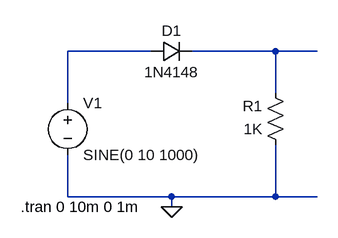
[diagram p0: schematic Positive and Negative Clipper.asc]
Positive and Negative Clipper.asc, the LTspice schematic file:
Version 4
SHEET 1 880 680
WIRE 368 144 240 144
WIRE 560 144 432 144
WIRE 624 144 560 144
WIRE 560 208 560 144
WIRE 240 224 240 144
WIRE 240 368 240 304
WIRE 400 368 240 368
WIRE 560 368 560 288
WIRE 560 368 400 368
WIRE 624 368 560 368
WIRE 400 384 400 368
FLAG 400 384 0
SYMBOL res 576 304 R180
WINDOW 0 36 76 Left 2
WINDOW 3 36 40 Left 2
SYMATTR InstName R1
SYMATTR Value 1K
SYMBOL diode 368 160 R270
WINDOW 0 32 32 VTop 2
WINDOW 3 0 32 VBottom 2
SYMATTR InstName D1
SYMATTR Value 1N4148
SYMBOL voltage 240 208 R0
SYMATTR InstName V1
SYMATTR Value SINE(0 10 1000)
TEXT 168 384 Left 2 !.tran 0 10m 0 1m

The netlist it stands for:
* Positive and Negative Clipper.asc
R1 0 N002 1K
D1 N001 N002 1N4148
V1 N001 0 SINE(0 10 1000)
.model D D
.lib standard.dio
.tran 0 10m 0 1m
.backanno
.end